# EAGLE design untitled (EAGLE 5.08)
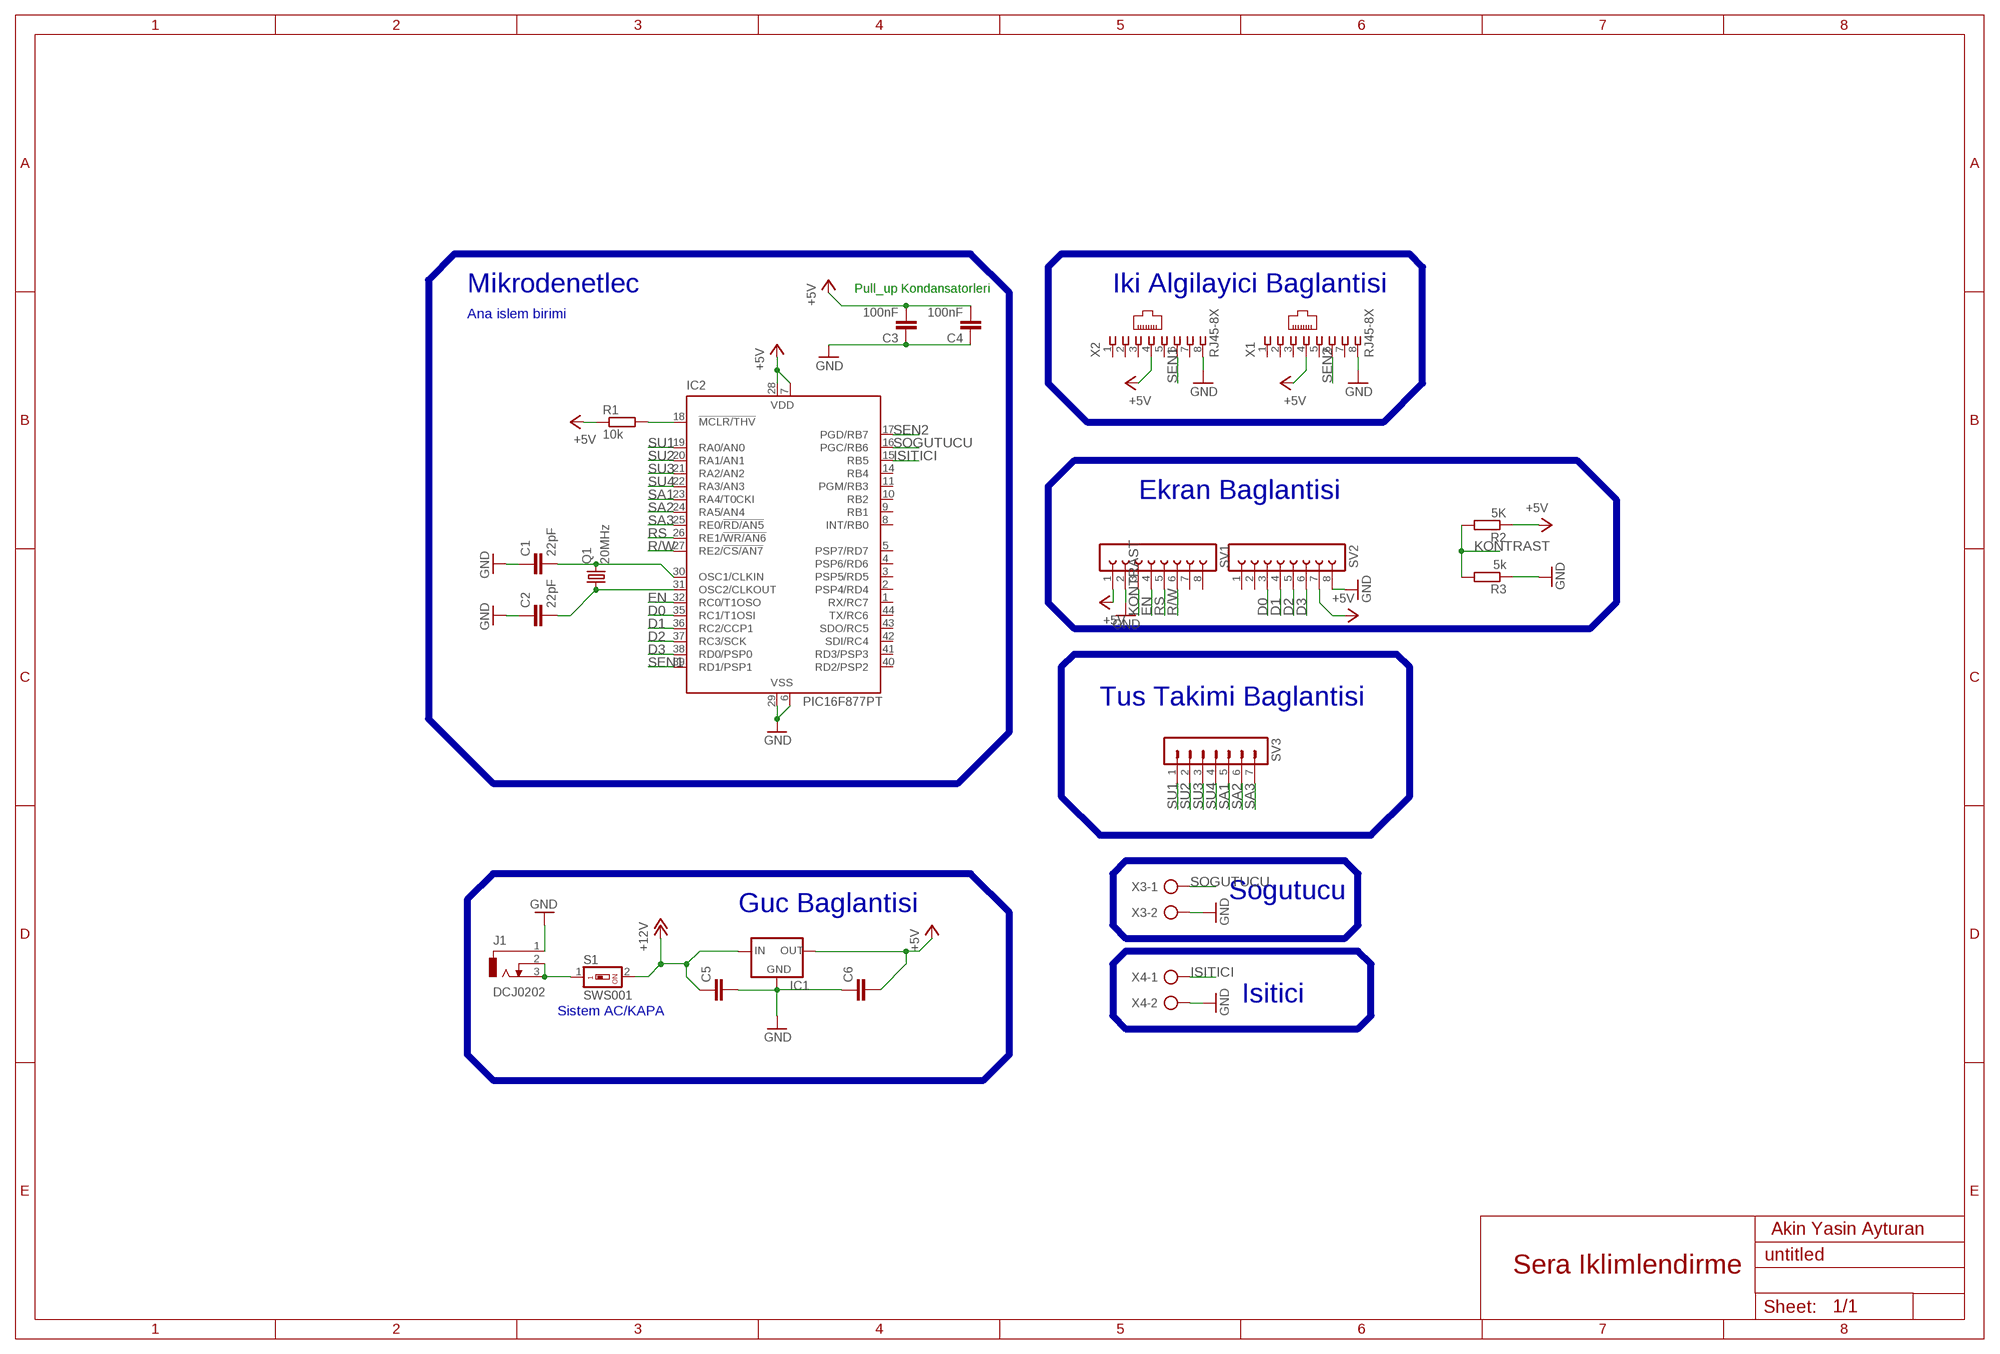
[diagram p0: schematic, sheet 1]

## Parts
C1  22pF  C-EUC0402  [C0402]
C2  22pF  C-EUC0402  [C0402]
C3  100nF  C-EUC1206  [C1206]
C4  100nF  C-EUC1206  [C1206]
C5  C-EU050-045X075  [C050-045X075]
C6  C-EU050-045X075  [C050-045X075]
IC1  78LXX  [78LXX]
IC2  PIC16F877PT  [TQFP44]
J1  DCJ0202  [DCJ0202]
Q1  20MHz  CRYSTALSM49  [SM49]
R1  10k  R-EU_M1206  [M1206]
R2  5K  R-EU_M1206  [M1206]
R3  5k  R-EU_M1206  [M1206]
S1  SWS001  [SMS-001]
SV1  FE08-1  [FE08]
SV2  FE08-1  [FE08]
SV3  MA07-1  [MA07-1]
X1  RJ45-8X  [RJ45-NO-SHIELD]
X2  RJ45-8X  [RJ45-NO-SHIELD]
X3  AK300/2  [AK300/2]
X4  AK300/2  [AK300/2]

## Nets
+5V: C3.2 C4.2 C6.2 IC1.OUT IC2.7(VDD) IC2.28(VDD) R1.1 R2.1 SV1.1 SV2.7 X1.4 X2.4
+12V: C5.1 IC1.IN S1.2
D0: IC2.35(RC1/T1OSI) SV2.3
D1: IC2.36(RC2/CCP1) SV2.4
D2: IC2.37(RC3/SCK) SV2.5
D3: IC2.38(RD0/PSP0) SV2.6
EN: IC2.32(RC0/T1OSO) SV1.4
GND: C1.1 C2.1 C3.1 C4.1 C5.2 C6.1 IC1.GND IC2.6(VSS) IC2.29(VSS) J1.1 R3.1 SV1.2 SV2.8 X1.8 X2.8 X3.2 X4.2
ISITICI: IC2.15(RB5) X4.1
KONTRAST: R2.2 R3.2 SV1.3
N$1: IC2.18(!MCLR/THV) R1.2
N$2: C1.2 IC2.30(OSC1/CLKIN) Q1.2
N$3: C2.2 IC2.31(OSC2/CLKOUT) Q1.1
N$4: J1.2 J1.3 S1.1
R/W: IC2.27(RE2/!CS/AN7) SV1.6
RS: IC2.26(RE1/!WR/AN6) SV1.5
SA1: IC2.23(RA4/T0CKI) SV3.5
SA2: IC2.24(RA5/AN4) SV3.6
SA3: IC2.25(RE0/!RD/AN5) SV3.7
SEN1: IC2.39(RD1/PSP1) X2.6
SEN2: IC2.17(PGD/RB7) X1.6
SOGUTUCU: IC2.16(PGC/RB6) X3.1
SU1: IC2.19(RA0/AN0) SV3.1
SU2: IC2.20(RA1/AN1) SV3.2
SU3: IC2.21(RA2/AN2) SV3.3
SU4: IC2.22(RA3/AN3) SV3.4
Unconnected: IC2.1(RX/RC7) IC2.2(PSP4/RD4) IC2.3(PSP5/RD5) IC2.4(PSP6/RD6) IC2.5(PSP7/RD7) IC2.8(INT/RB0) IC2.9(RB1) IC2.10(RB2) IC2.11(PGM/RB3) IC2.14(RB4) IC2.40(RD2/PSP2) IC2.41(RD3/PSP3) IC2.42(SDI/RC4) IC2.43(SDO/RC5) IC2.44(TX/RC6) SV1.7 SV1.8 SV2.1 SV2.2 X1.1 X1.2 X1.3 X1.5 X1.7 X2.1 X2.2 X2.3 X2.5 X2.7

## Buses
B$2
B$3
B$4
B$5
B$6
B$7
B$1

## Notes on the sheet
- Mikrodenetlec | Pull_up Kondansatorleri | Iki Algilayici Baglantisi
- Ana islem birimi
- Ekran Baglantisi
- Tus Takimi Baglantisi
- Sogutucu
- Guc Baglantisi
- Isitici
- Sistem AC/KAPA
- Akin Yasin Ayturan
- Sera Iklimlendirme

## Library data of the parts
C1-C6 = resistor:C-EU: CAPACITOR, European symbol
IC1 = v-reg:78LXX: VOLTAGE REGULATOR
IC2 = microchip:PIC16F87*: MICROCONTROLLER
J1 = con-jack:DCJ0202: DC POWER JACK Source: DCJ0202.pdf
Q1 = crystal:CRYSTAL: CRYSTAL
R1-R3 = resistor:R-EU_: RESISTOR, European symbol
S1 = smd-special:SWS001: SMD Dip Switch 1 pol.
SV1 SV2 = con-lsta:FE08-1: FEMALE HEADER
SV3 = con-lstb:MA07-1: PIN HEADER
X1 X2 = con-tycoelectronics:RJ45: CORCOM Modular RJ Jacks No Shield Source: www.tycoelectronics.com .. ENG_DS_1654001_1099_RJ_L_0507.pdf
X3 X4 = con-ptr500:AK300/2: CONNECTOR

## Board
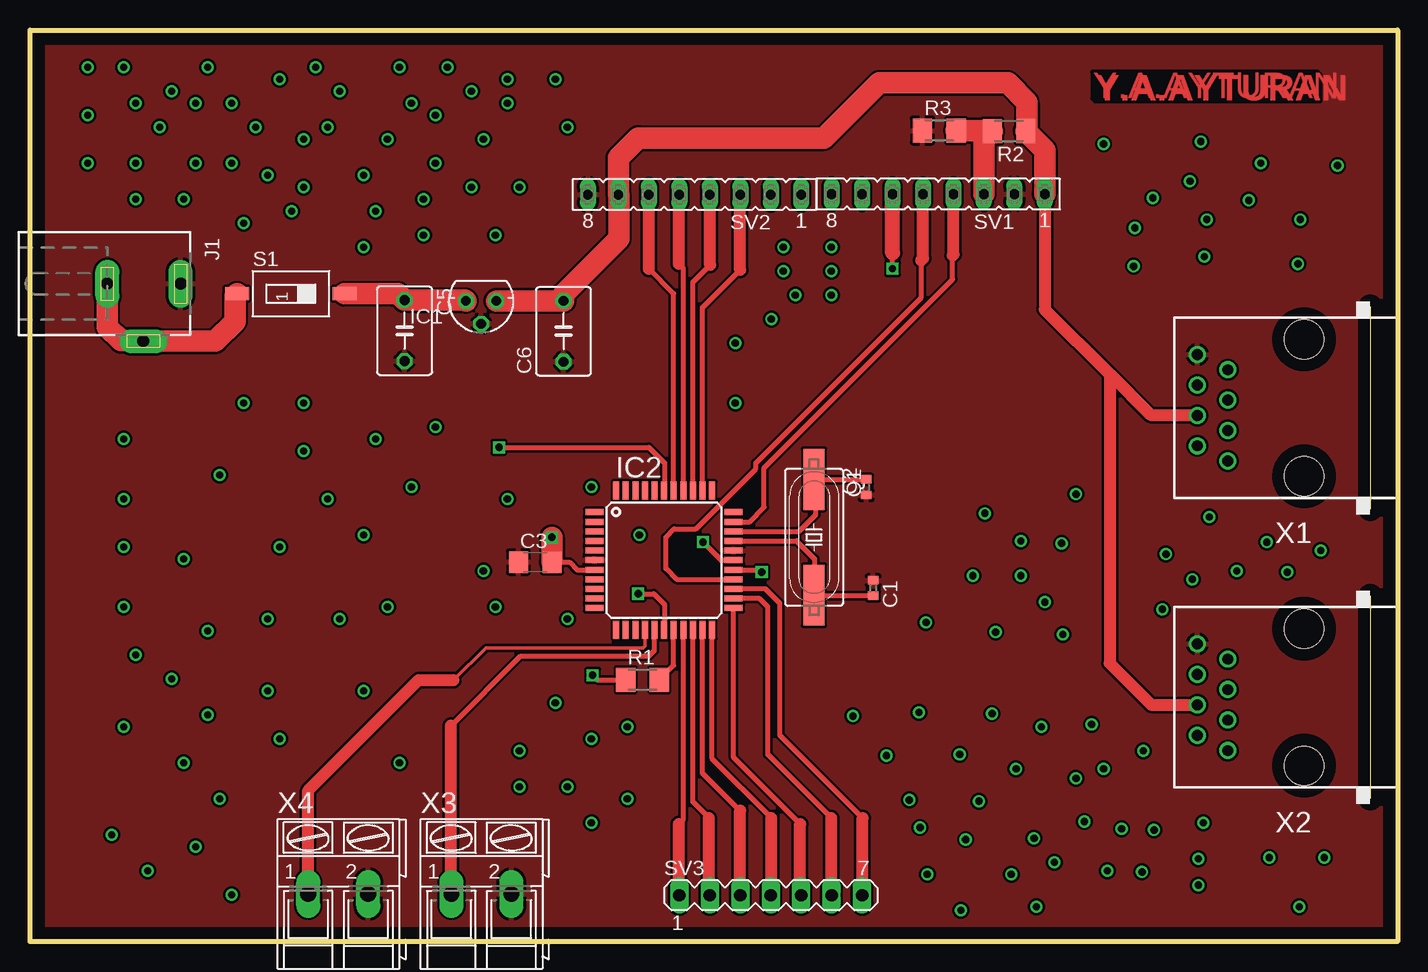
[diagram p1: board, top side]
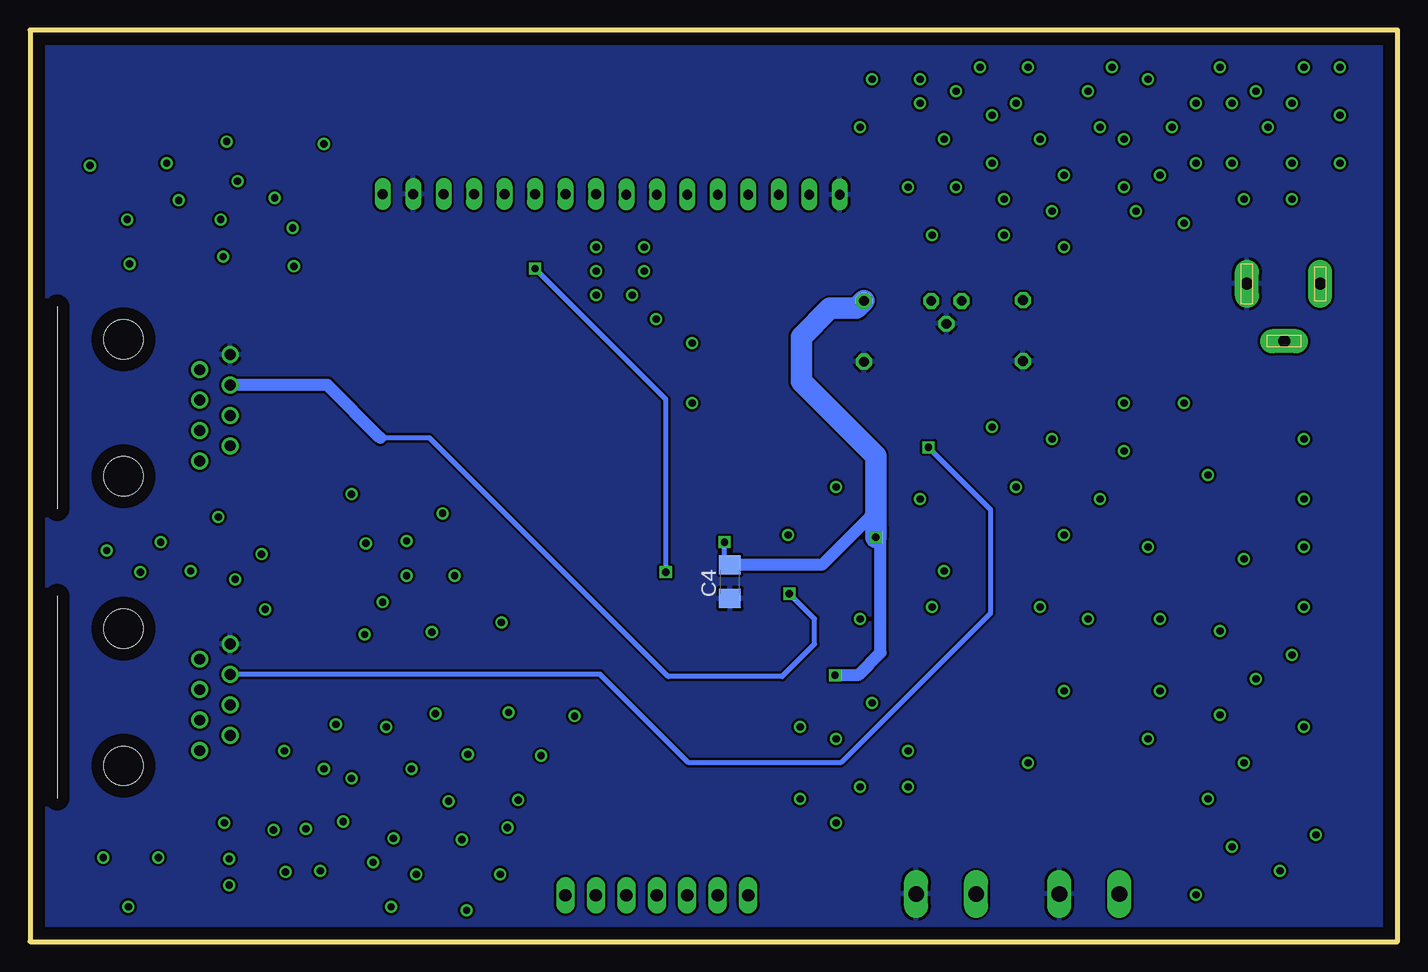
[diagram p2: board, bottom side, seen from below]

Size 114 x 76 mm. Coordinates in mm from the lower left corner, seen from the top.
Outline: 0,0 0,76 114,76 114,0 0,0
Copper layers (1*16): Top 0.035mm / dielectric 1.5mm / Bottom 0.035mm
Design rules "default": minimum track width 10mil, minimum drill 24mil, track to track 8mil, track to pad 8mil, pad to pad 8mil, via to via 8mil, smd to smd 8mil, copper to edge 40mil, drill to drill 8mil, minimum pad ring 10mil, minimum via ring 8mil, stop-mask expansion 4mil, vias tented up to drill 0mil, thermal gap 10mil

### Footprints (pad centres in the part's own frame; a part is rotated, then mirrored left to right if it is on the bottom)
C0402 = smd 0.7 x 0.9: 1 -0.65,0; 2 0.65,0
C1206 = smd 1.6 x 1.8: 1 -1.4,0; 2 1.4,0
C050-045X075 = drill 0.813 octagon: 1 -2.54,0; 2 2.54,0
78LXX = drill 0.813 octagon: GND 0,1.905; IN 1.27,0; OUT -1.27,0
TQFP44 = smd 1.5 x 0.5: 1 -5.8,4; 2 -5.8,3.2; 3 -5.8,2.4; 4 -5.8,1.6; 5 -5.8,0.8; 6 -5.8,0; 7 -5.8,-0.8; 8 -5.8,-1.6; 9 -5.8,-2.4; 10 -5.8,-3.2; 11 -5.8,-4; 23 5.8,-4; 24 5.8,-3.2; 25 5.8,-2.4; 26 5.8,-1.6; 27 5.8,-0.8; 28 5.8,0; 29 5.8,0.8; 30 5.8,1.6; 31 5.8,2.4; 32 5.8,3.2; 33 5.8,4 | smd 0.5 x 1.5: 12 -4,-5.8; 13 -3.2,-5.8; 14 -2.4,-5.8; 15 -1.6,-5.8; 16 -0.8,-5.8; 17 0,-5.8; 18 0.8,-5.8; 19 1.6,-5.8; 20 2.4,-5.8; 21 3.2,-5.8; 22 4,-5.8; 34 4,5.8; 35 3.2,5.8; 36 2.4,5.8; 37 1.6,5.8; 38 0.8,5.8; 39 0,5.8; 40 -0.8,5.8; 41 -1.6,5.8; 42 -2.4,5.8; 43 -3.2,5.8; 44 -4,5.8
DCJ0202 = drill 1 pad 2 long: 1 0,3.1; 2 4.8,0; 3 0,-3
SM49 = smd 5.08 x 1.778: 1 -4.826,0; 2 4.826,0
M1206 = smd 1.6 x 2: 1 -1.4,0; 2 1.4,0
SMS-001 = smd 1.092 x 2.007: 1 0,-4.496; 2 0,4.496
FE08 = drill 0.813 long: 1 -8.89,0; 2 -6.35,0; 3 -3.81,0; 4 -1.27,0; 5 1.27,0; 6 3.81,0; 7 6.35,0; 8 8.89,0
MA07-1 = drill 1.016 long: 1 -7.62,0; 2 -5.08,0; 3 -2.54,0; 4 0,0; 5 2.54,0; 6 5.08,0; 7 7.62,0
RJ45-NO-SHIELD = drill 0.9 pad 1.4 round: 1 -4.445,6.35; 2 -3.175,8.89; 3 -1.905,6.35; 4 -0.635,8.89; 5 0.635,6.35; 6 1.905,8.89; 7 3.175,6.35; 8 4.445,8.89 | hole 3.251: -5.715,0; 5.715,0
AK300/2 = drill 1.321 long: 1 -2.515,0; 2 2.489,0

### Placement (x,y rotation side)
C1  70.29,29.47 270 top
C2  69.71,37.88 90 top
C3  42.12,31.64 0 top
C4  55.66,30 90 bottom
C5  31.22,50.93 270 top
C6  44.48,50.88 90 top
IC1  37.61,53.41 180 top
IC2  52.86,31.8 0 top
J1  9.45,54.85 270 top
Q1  65.36,33.7 270 top
R1  51.06,21.82 0 top
R2  81.62,67.58 180 top
R3  75.8,67.62 0 top
S1  21.75,54.01 270 top
SV1  75.71,62.32 180 top
SV2  55.4,62.28 180 top
SV3  61.75,3.86 0 top
X1  106.2,44.5 90 top
X2  106.2,20.37 90 top
X3  37.64,3.96 0 top
X4  25.71,3.96 0 top

### Tracks (layer width: path | path; a pad name or v marks a point on that pad's centre or on a via)
+5V  (via drill 0.6)
  Top 0.406: C3.2 44.96,31.64 45.6,31 IC2.7 | R1.1 47.28,21.82 v46.9,22.2 | IC2.28 57.6,31.8 v56.1,33.3
  Top 1.016: SV1.1 84.6,52.7 90,47.3 | 90,47.3 93.4,43.9 97.28,43.9 X1.4 | X2.4 93.47,19.73 90,23.2 90,47.3
  Top 1.778: IC1.OUT C6.2 44.48,53.98 49.1,58.6 49.1,62.23 SV2.7 49.05,65.35 50.7,67 66.2,67 70.8,71.6 81.5,71.6 83.1,70 83.1,67.66 R2.1 84.6,66 SV1.1 | C3.2 43.52,33.68 v43.5,33.7
  Bottom 0.406: v56.1,33.3 56.1,31.84 C4.2
  Bottom 1.016: v46.9,22.2 45,22.2 43.1,24.1 43.1,34.2 43.5,34.6 | C4.2 48,31.4 44,35.4 43.6,35.4 43.5,35.5
  Bottom 1.778: v43.5,33.7 43.5,34.6 43.5,35.5 43.5,40.5 49.7,46.7 49.7,50.4 47.3,52.8 45.1,52.8 C6.2
+12V
  Top 1.778: S1.2 30.68,54.01 C5.1 36.28,53.47 IC1.IN
D0
  Top 0.406: IC2.35 56.06,52.86 59.2,56
  Top 1.016: 59.2,56 SV2.3
D1
  Top 0.406: IC2.36 55.26,54.96 56.7,56.4
  Top 1.016: 56.7,56.4 56.7,62.25 SV2.4
D2
  Top 0.406: IC2.37 54.46,56.14 54.1,56.5
  Top 1.016: 54.1,56.5 54.1,62.25 SV2.5
D3
  Top 0.406: IC2.38 53.66,54.04 51.6,56.1
  Top 1.016: 51.6,56.1 SV2.6
EN
  Top 0.406: 76.9,57.2 76.9,55.2 61.2,39.5 61.2,36.2 60,35 IC2.32
  Top 1.016: SV1.4 76.98,57.28 76.9,57.2
GND
  pour Top: 0.8,61.9 0.8,0.9 112.8,0.9 112.8,74.9 0.8,74.9
  pour Bottom: 0.8,74.9 0.8,0.9 112.8,0.9 112.8,74.9
ISITICI
  Top 0.305: IC2.15 51.26,24.66 51.1,24.5 38,24.5 35.3,21.8
  Top 1.016: 35.3,21.8 32.4,21.8 23.2,12.6 X4.1
KONTRAST
  Top 1.778: SV1.3 79.52,66.88 R2.2 80.18,67.62 R3.2
N$1
  Top 0.406: IC2.18 53.66,23.02 R1.2
N$2
  Top 0.406: IC2.30 63.9,33.4 65.4,31.9 65.4,28.91 Q1.2 70.24,28.87 C1.2
N$3
  Top 0.406: IC2.31 64.1,34.2 65.5,35.6 65.5,38.39 Q1.1 C2.2
N$4
  Top 1.778: J1.3 6.45,51.25 7.6,50.1 9.4,50.1 J1.2 15.45,50.05 17.1,51.7 17.1,53.86 S1.1
N$5  (via drill 0.6)
  other vias: 7.8,41.9
N$6  (via drill 0.6)
  other vias: 7.8,36.9
N$7  (via drill 0.6)
  other vias: 7.8,32.9
N$8  (via drill 0.6)
  other vias: 7.8,27.9
N$9  (via drill 0.6)
  other vias: 8.8,23.9
N$10  (via drill 0.6)
  other vias: 7.8,17.9
N$11  (via drill 0.6)
  other vias: 6.8,8.9
N$12  (via drill 0.6)
  other vias: 12.8,14.9
N$13  (via drill 0.6)
  other vias: 11.8,21.9
N$14  (via drill 0.6)
  other vias: 19.8,26.9
N$15  (via drill 0.6)
  other vias: 12.8,31.9
N$16  (via drill 0.6)
  other vias: 15.8,38.9
N$17  (via drill 0.6)
  other vias: 24.8,36.9
N$18  (via drill 0.6)
  other vias: 20.8,32.9
N$19  (via drill 0.6)
  other vias: 25.8,26.9
N$20  (via drill 0.6)
  other vias: 19.8,20.9
N$21  (via drill 0.6)
  other vias: 27.8,20.9
N$22  (via drill 0.6)
  other vias: 14.8,25.9
N$23  (via drill 0.6)
  other vias: 22.8,44.9
N$24  (via drill 0.6)
  other vias: 17.8,44.9
N$25  (via drill 0.6)
  other vias: 22.8,40.9
N$26  (via drill 0.6)
  other vias: 33.8,42.9
N$27  (via drill 0.6)
  other vias: 28.8,41.9
N$28  (via drill 0.6)
  other vias: 27.8,33.9
N$29  (via drill 0.6)
  other vias: 29.8,27.9
N$30  (via drill 0.6)
  other vias: 31.8,37.9
N$31  (via drill 0.6)
  other vias: 39.8,36.9
N$32  (via drill 0.6)
  other vias: 37.8,30.9
N$33  (via drill 0.6)
  other vias: 38.8,27.9
N$34  (via drill 0.6)
  other vias: 46.8,37.9
N$35  (via drill 0.6)
  other vias: 44.8,26.9
N$36  (via drill 0.6)
  other vias: 50.8,33.9
N$37  (via drill 0.6)
  other vias: 43.8,19.9
N$38  (via drill 0.6)
  other vias: 49.8,17.9
N$39  (via drill 0.6)
  other vias: 46.8,16.9
N$40  (via drill 0.6)
  other vias: 40.8,15.9
N$41  (via drill 0.6)
  other vias: 49.8,11.9
N$42  (via drill 0.6)
  other vias: 40.8,12.9
N$43  (via drill 0.6)
  other vias: 46.8,9.9
N$44  (via drill 0.6)
  other vias: 44.8,12.9
N$45  (via drill 0.6)
  other vias: 30.8,14.9
N$46  (via drill 0.6)
  other vias: 15.8,11.9
N$47  (via drill 0.6)
  other vias: 13.8,7.9
N$48  (via drill 0.6)
  other vias: 16.8,3.9
N$49  (via drill 0.6)
  other vias: 9.8,5.9
N$50  (via drill 0.6)
  other vias: 20.8,16.9
N$51  (via drill 0.6)
  other vias: 14.8,18.9
N$52  (via drill 0.6)
  other vias: 4.8,72.9
N$53  (via drill 0.6)
  other vias: 4.8,68.9
N$54  (via drill 0.6)
  other vias: 4.8,64.9
N$55  (via drill 0.6)
  other vias: 8.8,64.9
N$56  (via drill 0.6)
  other vias: 10.8,67.9
N$57  (via drill 0.6)
  other vias: 11.8,70.9
N$58  (via drill 0.6)
  other vias: 7.8,72.9
N$59  (via drill 0.6)
  other vias: 8.8,69.9
N$60  (via drill 0.6)
  other vias: 20.8,71.9
N$61  (via drill 0.6)
  other vias: 18.8,67.9
N$62  (via drill 0.6)
  other vias: 16.8,69.9
N$63  (via drill 0.6)
  other vias: 14.8,72.9
N$64  (via drill 0.6)
  other vias: 16.8,64.9
N$65  (via drill 0.6)
  other vias: 13.8,64.9
N$66  (via drill 0.6)
  other vias: 13.8,69.9
N$67  (via drill 0.6)
  other vias: 22.8,62.9
N$68  (via drill 0.6)
  other vias: 17.8,59.9
N$69  (via drill 0.6)
  other vias: 12.8,61.9
N$70  (via drill 0.6)
  other vias: 8.8,61.9
N$71  (via drill 0.6)
  other vias: 21.8,60.9
N$72  (via drill 0.6)
  other vias: 27.8,57.9
N$73  (via drill 0.6)
  other vias: 19.8,63.9
N$74  (via drill 0.6)
  other vias: 24.8,67.9
N$75  (via drill 0.6)
  other vias: 22.8,66.9
N$76  (via drill 0.6)
  other vias: 25.8,70.9
N$77  (via drill 0.6)
  other vias: 31.8,69.9
N$78  (via drill 0.6)
  other vias: 29.8,66.9
N$79  (via drill 0.6)
  other vias: 27.8,63.9
N$80  (via drill 0.6)
  other vias: 32.8,61.9
N$81  (via drill 0.6)
  other vias: 32.8,58.9
N$82  (via drill 0.6)
  other vias: 38.8,58.9
N$83  (via drill 0.6)
  other vias: 28.8,60.9
N$84  (via drill 0.6)
  other vias: 33.8,64.9
N$85  (via drill 0.6)
  other vias: 40.8,62.9
N$86  (via drill 0.6)
  other vias: 36.8,62.9
N$87  (via drill 0.6)
  other vias: 37.8,66.9
N$88  (via drill 0.6)
  other vias: 33.8,68.9
N$89  (via drill 0.6)
  other vias: 44.8,67.9
N$90  (via drill 0.6)
  other vias: 39.8,69.9
N$91  (via drill 0.6)
  other vias: 36.8,70.9
N$92  (via drill 0.6)
  other vias: 43.8,71.9
N$93  (via drill 0.6)
  other vias: 39.8,71.9
N$94  (via drill 0.6)
  other vias: 34.8,72.9
N$95  (via drill 0.6)
  other vias: 30.8,72.9
N$96  (via drill 0.6)
  other vias: 23.8,72.9
N$97  (via drill 0.6)
  other vias: 62.8,57.9
N$98  (via drill 0.6)
  other vias: 66.8,57.9
N$99  (via drill 0.6)
  other vias: 62.8,55.9
N$100  (via drill 0.6)
  other vias: 61.8,51.9
N$101  (via drill 0.6)
  other vias: 58.8,49.9
N$102  (via drill 0.6)
  other vias: 58.8,44.9
N$103  (via drill 0.6)
  other vias: 66.8,53.9
N$104  (via drill 0.6)
  other vias: 63.8,53.9
N$105  (via drill 0.6)
  other vias: 66.8,55.9
N$106  (via drill 0.6)
  other vias: 68.6,18.8
N$107  (via drill 0.6)
  other vias: 71.4,15.5
N$108  (via drill 0.6)
  other vias: 73.3,11.8
N$109  (via drill 0.6)
  other vias: 74.8,5.6
N$110  (via drill 0.6)
  other vias: 74.2,9.5
N$111  (via drill 0.6)
  other vias: 81.8,5.6
N$112  (via drill 0.6)
  other vias: 79.1,11.7
N$113  (via drill 0.6)
  other vias: 78,8.5
N$114  (via drill 0.6)
  other vias: 77.5,15.6
N$115  (via drill 0.6)
  other vias: 84.3,17.9
N$116  (via drill 0.6)
  other vias: 74.1,19.1
N$117  (via drill 0.6)
  other vias: 82.2,14.4
N$118  (via drill 0.6)
  other vias: 87.9,10
N$119  (via drill 0.6)
  other vias: 83.7,8.6
N$120  (via drill 0.6)
  other vias: 89.5,14.4
N$121  (via drill 0.6)
  other vias: 80.2,19
N$122  (via drill 0.6)
  other vias: 88.5,18.1
N$123  (via drill 0.6)
  other vias: 92.8,15.9
N$124  (via drill 0.6)
  other vias: 93.7,9.3
N$125  (via drill 0.6)
  other vias: 87.2,13.6
N$126  (via drill 0.6)
  other vias: 85.4,6.6
N$127  (via drill 0.6)
  other vias: 92.7,5.8
N$128  (via drill 0.6)
  other vias: 89.8,5.9
N$129  (via drill 0.6)
  other vias: 91,9.4
N$130  (via drill 0.6)
  other vias: 97.8,9.9
N$131  (via drill 0.6)
  other vias: 97.4,4.7
N$132  (via drill 0.6)
  other vias: 97.4,6.9
N$133  (via drill 0.6)
  other vias: 105.8,2.9
N$134  (via drill 0.6)
  other vias: 107.9,7
N$135  (via drill 0.6)
  other vias: 103.3,7
N$136  (via drill 0.6)
  other vias: 83.9,2.9
N$137  (via drill 0.6)
  other vias: 77.6,2.6
N$138  (via drill 0.6)
  other vias: 74.7,26.6
N$139  (via drill 0.6)
  other vias: 79.6,35.7
N$140  (via drill 0.6)
  other vias: 78.6,30.5
N$141  (via drill 0.6)
  other vias: 84.6,28.3
N$142  (via drill 0.6)
  other vias: 82.6,33.4
N$143  (via drill 0.6)
  other vias: 87.2,37.3
N$144  (via drill 0.6)
  other vias: 82.6,30.5
N$145  (via drill 0.6)
  other vias: 80.5,25.8
N$146  (via drill 0.6)
  other vias: 86,33.2
N$147  (via drill 0.6)
  other vias: 86.1,25.6
N$148  (via drill 0.6)
  other vias: 98.3,35.4
N$149  (via drill 0.6)
  other vias: 96.9,30.2
N$150  (via drill 0.6)
  other vias: 94.4,27.7
N$151  (via drill 0.6)
  other vias: 94.7,32.3
N$152  (via drill 0.6)
  other vias: 100.6,30.9
N$153  (via drill 0.6)
  other vias: 107.6,32.6
N$154  (via drill 0.6)
  other vias: 103.1,33.3
N$155  (via drill 0.6)
  other vias: 104.8,30.8
N$156  (via drill 0.6)
  other vias: 93.6,62
N$157  (via drill 0.6)
  other vias: 92.1,59.5
N$158  (via drill 0.6)
  other vias: 92,56.3
N$159  (via drill 0.6)
  other vias: 97.9,57.1
N$160  (via drill 0.6)
  other vias: 105.9,60.2
N$161  (via drill 0.6)
  other vias: 109,64.7
N$162  (via drill 0.6)
  other vias: 102.6,64.9
N$163  (via drill 0.6)
  other vias: 101.6,61.8
N$164  (via drill 0.6)
  other vias: 96.7,63.4
N$165  (via drill 0.6)
  other vias: 97.6,66.7
N$166  (via drill 0.6)
  other vias: 98.1,60.2
N$167  (via drill 0.6)
  other vias: 105.7,56.5
N$168  (via drill 0.6)
  other vias: 89.5,66.5
R/W  (via drill 0.6)
  Top 0.406: IC2.27 60.8,31 v61,30.8 | v71.9,56.1 71.9,57.4
  Top 1.27: 71.9,57.4 SV1.6
  Bottom 0.406: v61,30.8 61,45.2 v71.9,56.1
RS
  Top 0.406: 74.3,56.8 74.3,53.7 60.5,39.9 60.5,39.4 55.5,34.4 53.7,34.4 53,33.7 53,31.1 53.9,30.2 IC2.26
  Top 1.016: SV1.5 74.44,56.94 74.3,56.8
SA1
  Top 0.406: IC2.23 58.66,15.34 64.2,9.8
  Top 1.016: 64.2,9.8 64.2,3.95 SV3.5
SA2
  Top 0.406: IC2.24 60.8,28.6 61.5,27.9 61.5,15.6 66.8,10.3
  Top 1.016: 66.8,10.3 66.8,3.89 SV3.6
SA3
  Top 0.406: IC2.25 61.3,29.4 62.5,28.2 62.5,17.2 69.4,10.3
  Top 1.016: 69.4,10.3 69.4,3.89 SV3.7
SEN1  (via drill 0.6)
  Top 0.406: v39.1,41.2 51.6,41.2 52.9,39.9 52.9,37.64 IC2.39
  Bottom 0.406: X2.6 66.47,22.27 59.1,14.9 46.4,14.9 33.9,27.4 33.9,36 v39.1,41.2
SEN2  (via drill 0.6)
  Top 0.406: v50.7,29 52,29 52.9,28.1 52.9,26.04 IC2.17
  Bottom 0.406: 84.8,42 80.7,42 60.8,22.1 51.3,22.1 48.6,24.8 48.6,26.9 v50.7,29
  Bottom 1.016: X1.6 89.2,46.41 84.8,42
SOGUTUCU
  Top 0.406: IC2.16 52.06,24.26 51.6,23.8 40.9,23.8 35.1,18
  Top 1.016: 35.1,18 35.1,3.98 X3.1
SU1
  Top 0.406: IC2.19 54.46,10.16 54.1,9.8
  Top 1.016: 54.1,9.8 54.1,3.89 SV3.1
SU2
  Top 0.406: IC2.20 55.26,11.64 56.6,10.3
  Top 1.016: 56.6,10.3 56.6,3.93 SV3.2
SU3
  Top 0.406: IC2.21 56.06,14.04 59.2,10.9
  Top 1.016: 59.2,10.9 SV3.3
SU4
  Top 0.406: IC2.22 56.86,15.24 61.8,10.3
  Top 1.016: 61.8,10.3 61.8,3.91 SV3.4

### Text on the board
Top: Y.A.AYTURAN | Y.A.AYTURAN